# Altium project 2023-02-24_PIFHomework_DigitalClock_ThangHo_V1-01.PrjPcb
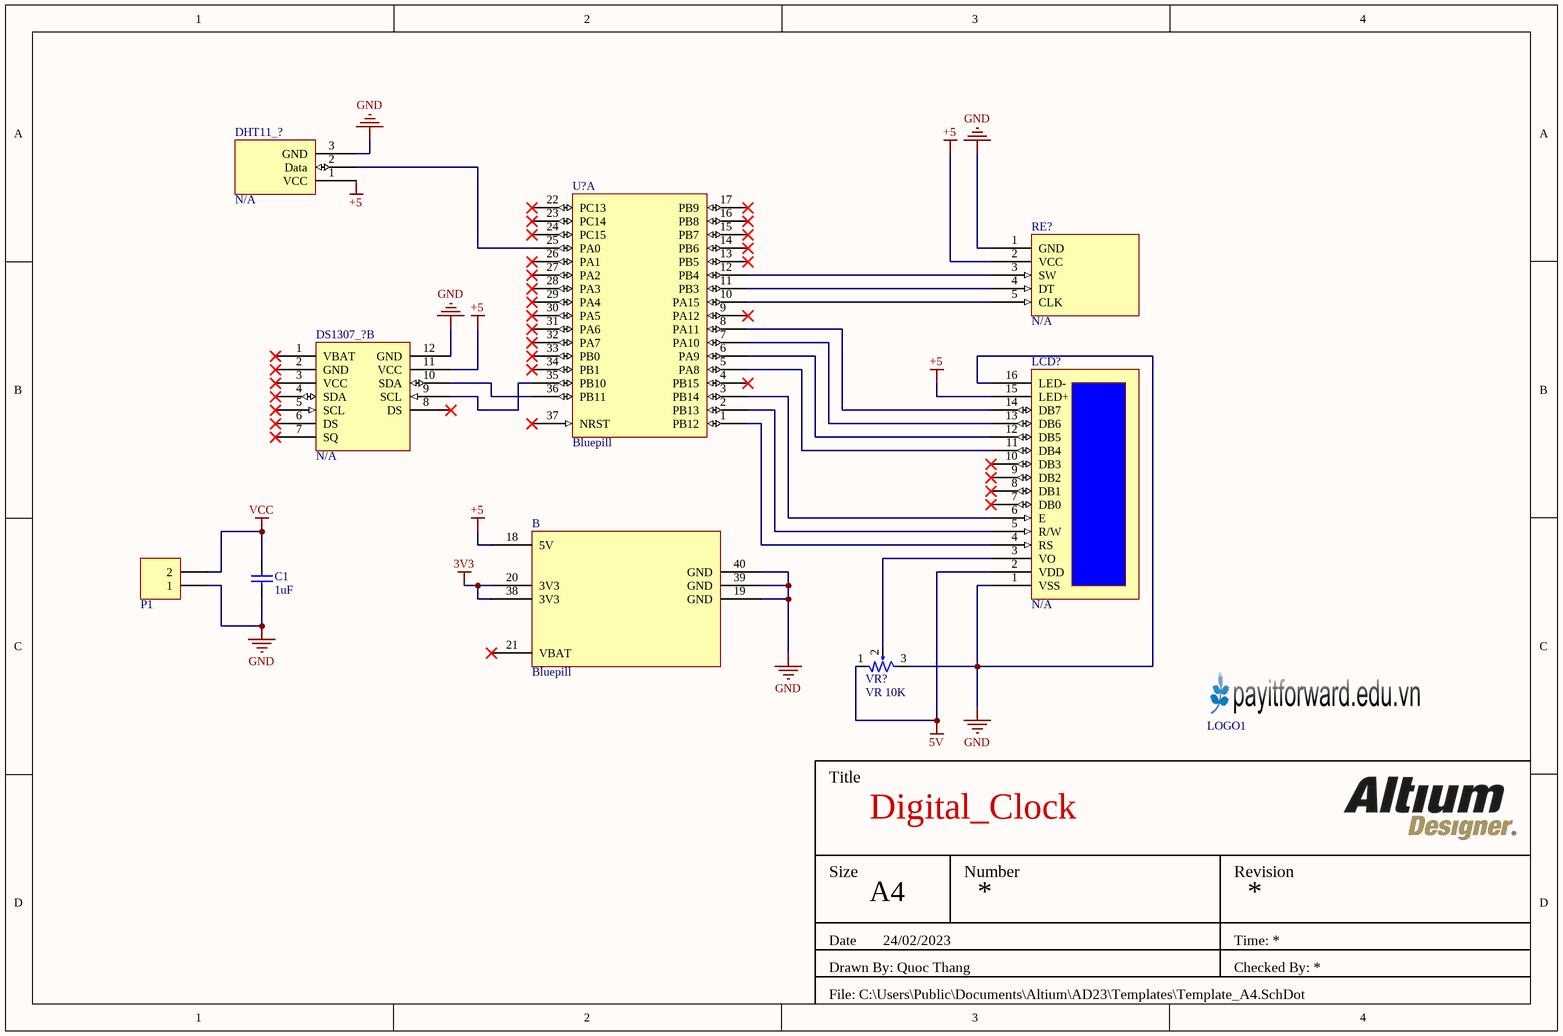
[diagram p0: 2023-02-24_PIFHomework_DigitalClock_ThangHo_V1-01.SchDoc]
1 sheet, 10 parts. Net scope: global (net labels, ports and power ports of the same name join across sheets).
Board file: 2023-02-24_PIFHomework_DigitalClock_ThangHo_V1-01.PcbDoc

## Sheet 2023-02-24_PIFHomework_DigitalClock_ThangHo_V1-01.SchDoc
size A4; SheetNumber: 1; SheetTotal: 1

### Parts
?  Bluepill  [STM32F103C8T6]  (part B of 2)
C1  value 1uF  [CAP-SM-0805]  (hidden comment: Cap Non-Pol SMD)
DHT11_?  N/A  [DHT11]
DS1307_?  N/A  [DS1307]  (part B of 2)
LCD?  N/A  [LCD1602]
LOGO1  LOGO PIF  [PIF LOGO SMALL TOP]  (value not drawn)
P1  Domino 2  [DOMINO 2- 5mm]  (value not drawn)
RE?  N/A  [Rotary_Encoder]
U?  Bluepill  [STM32F103C8T6]  (part A of 2)
VR?  value VR 10K  [Varistor 1]  (hidden comment: 10K)

### Nets
3V3: ?.20(3V3) ?.38(3V3)
5V: LCD?.2(VDD) VR?.1
+5: ?.18(5V) DHT11_?.1(VCC) DS1307_?.11(VCC) LCD?.15(LED+) RE?.2(VCC)
GND: ?.19(GND) ?.39(GND) ?.40(GND) C1.1 DHT11_?.3(GND) DS1307_?.12(GND) LCD?.1(VSS) LCD?.16(LED-) P1.1 RE?.1(GND) VR?.3
VCC: C1.2 P1.2
NetDHT11_?_2: DHT11_?.2(Data) U?.25(PA0)
NetDS1307_?_9: DS1307_?.9(SCL) U?.35(PB10)
NetDS1307_?_10: DS1307_?.10(SDA) U?.36(PB11)
NetLCD?_3: LCD?.3(VO) VR?.2
NetLCD?_4: LCD?.4(RS) U?.1(PB12)
NetLCD?_5: LCD?.5(R/W) U?.2(PB13)
NetLCD?_6: LCD?.6(E) U?.3(PB14)
NetLCD?_11: LCD?.11(DB4) U?.5(PA8)
NetLCD?_12: LCD?.12(DB5) U?.6(PA9)
NetLCD?_13: LCD?.13(DB6) U?.7(PA10)
NetLCD?_14: LCD?.14(DB7) U?.8(PA11)
NetRE?_3: RE?.3(SW) U?.12(PB4)
NetRE?_4: RE?.4(DT) U?.11(PB3)
NetRE?_5: RE?.5(CLK) U?.10(PA15)

Not connected (* = marked no-connect by the designer): ? 21(VBAT)*; DS1307_? 1(VBAT)* 2(GND)* 3(VCC)* 4(SDA)* 5(SCL)* 6(DS)* 7(SQ)* 8(DS)*; LCD? 7(DB0)* 8(DB1)* 9(DB2)* 10(DB3)*; U? 4(PB15)* 9(PA12)* 13(PB5)* 14(PB6)* 15(PB7)* 16(PB8)* 17(PB9)* 22(PC13)* 23(PC14)* 24(PC15)* 26(PA1)* 27(PA2)* 28(PA3)* 29(PA4)* 30(PA5)* 31(PA6)* 32(PA7)* 33(PB0)* 34(PB1)* 37(NRST)*

### Notes on the sheet
- Title
- Digital_Clock
- Size
- A4
- Number
- *
- Revision
- Date
- Drawn By: Quoc Thang
- 24/02/2023
- Time: *
- Checked By: *
- File: C:\Users\Public\Documents\Altium\AD23\Templates\Template_A4.SchDot

### Library data of the parts
? U? = STM32F103C8T6: STM32F103C8T6, mbed-Enabled Development Bluepill STM32F1 ARM® Cortex®-M3 MCU 32-Bit Embedded Evaluation Board; Manufacturer: STMicroelectronics; Core Size: 32-Bit Single-Core; Speed: 72MHz; Connectivity: CANbus, I²C, IrDA, LINbus, SPI, UART/USART, USB; Peripherals: DMA, Motor Control PWM, PDR, POR, PVD, PWM, Temp Sensor, WDT; Number of I/O: 37; Program Memory Size: 64KB (64K x 8); Program Memory Type: FLASH; RAM Size: 20K x 8; Voltage - Supply (Vcc/Vdd): 2V ~ 3.6V; Data Converters: A/D 10x12b; Oscillator Type: Internal; Series: STM32F1; Core Processor: ARM® Cortex®-M3; Operating Temperature: 40°C ~ 85°C (TA); Mounting Type: Surface Mount; Package / Case: 48-LQFP; Base Product Number: STM32F103; ComponentLink1Description: MPU; ComponentLink1URL: https://www.thegioiic.com/stm32f103c8t6; ComponentLink2Description: Kit Bluepill; ComponentLink2URL: https://hshop.vn/products/kit-ra-chon-stm32f103c8t6; ComponentLink3Description: Datasheet; ComponentLink3URL: https://www.st.com/resource/en/datasheet/cd00161566.pdf
C1 = Cap Non-Pol SMD: Capacitor
DHT11_? = DHT11: Temperature Humidity Sensor 16bi; Manufacturer: UNIVERSAL-SOLDER Electronics Ltd; Product Status: Active; Sensor Type: Humidity, Temperature; Output Type: Digital; Output: 16b; Accuracy: ±5% RH; Voltage - Supply: 3.5V ~ 5.5V; ComponentLink1Description: Datasheet; ComponentLink1URL: https://www.mouser.com/datasheet/2/758/DHT11-Technical-Data-Sheet-Translated-Version-1143054.pdf; ComponentLink2Description: Thegioiic; ComponentLink2URL: https://www.thegioiic.com/dht11-mach-cam-bien-nhiet-do-va-do-am-den; Package: Bulk; Mounting Type: Through Hole; Package / Case: 3-SIP Module
DS1307_? = DS1307: IC RTC CLOCK/CALENDAR I2C 8DIP; Manufacturer: Analog Devices Inc./Maxim Integrated; Product Status: Obsolete; Memory Size: 56B; Time Format: HH:MM:SS (12/24 hr); Date Format: YY-MM-DD-dd; Interface: I²C, 2-Wire Serial; Voltage - Supply: 4.5V ~ 5.5V; Voltage - Supply, Battery: 2V ~ 3.5V; Current - Timekeeping (Max): 200µA @ 5V; Package: Tube; Type: Clock/Calendar; Features: Leap Year, NVSRAM, Square Wave Output; Operating Temperature: 0°C ~ 70°C; Mounting Type: Through Hole; Package / Case: 8-DIP (0.300", 7.62mm); Supplier Device Package: 8-PDIP; Base Product Number: DS1307; ComponentLink1Description: Datasheet; ComponentLink1URL: https://www.sparkfun.com/datasheets/Components/DS1307.pdf; ComponentLink2Description: Thegioiic; ComponentLink2URL: https://www.thegioiic.com/ds1307-ic-rtc-clock-calendar-56b-8-dip
LCD? = LCD1602: BLUE LCD 1602 2x16 Character Mat; Manufacturer: UNIVERSAL-SOLDER Electronics Ltd; Product Status: Active; Number of Characters: 32; Display Format: 16 x 2; Character Format: 5 x 8 Dots; Display Type: STN - Super-Twisted Nematic; Character Size: 5.15mm H x 2.90mm W; Outline L x W x H: 80.00mm x 36.00mm x 11.00mm; Viewing Area: 55.70mm L x 11.00mm W; Backlight: LED - Yellow/Green; Voltage - Supply: 4.5V ~ 5.5V; Dot Size: 0.55mm W x 0.65mm H; Controller Type: HD44780; Text Color: White; Package: Bag; Operating Temperature: -20°C ~ 70°C; Background Color: Blue; ComponentLink1Description: Hshop; ComponentLink1URL: https://hshop.vn/products/lcd-text-lcd1602-xanh-lo; ComponentLink2Description: Datasheet; ComponentLink2URL: https://www.waveshare.com/datasheet/LCD_en_PDF/LCD1602.pdf
P1 = Domino 2: Domino, 2-Pin; LatestRevisionDate: 17-Jul-2002; LatestRevisionNote: Re-released for DXP Platform.; Publisher: Altium Limited
RE? = Rotary Encoder: ROTARY ENCODER MECHANICAL 16PPR; Manufacturer: CUI Devices; Product Status: Obsolete; Output Type: Quadrature (Incremental); Pulses per Revolution: 16; Voltage - Supply: 5V; Actuator Type: 6mm Dia Flatted End; Detent: Yes; Rotational Life (Cycles Min): 500K; Series: RME12; Encoder Type: Mechanical; Built in Switch: Yes; Mounting Type: Panel, PCB Through Hole; Orientation: Vertical; Termination Style: PC Pin; ComponentLink1Description: Hshop; ComponentLink1URL: https://hshop.vn/products/mach-volume-xoay-encoder; ComponentLink2Description: Datasheet; ComponentLink2URL: http://handsontec.com/dataspecs/module/Rotary%20Encoder.pdf
VR? = Var Resistor